# EAGLE design SparkFun_6DoF_ISM330DHCX (EAGLE 9.6.2)
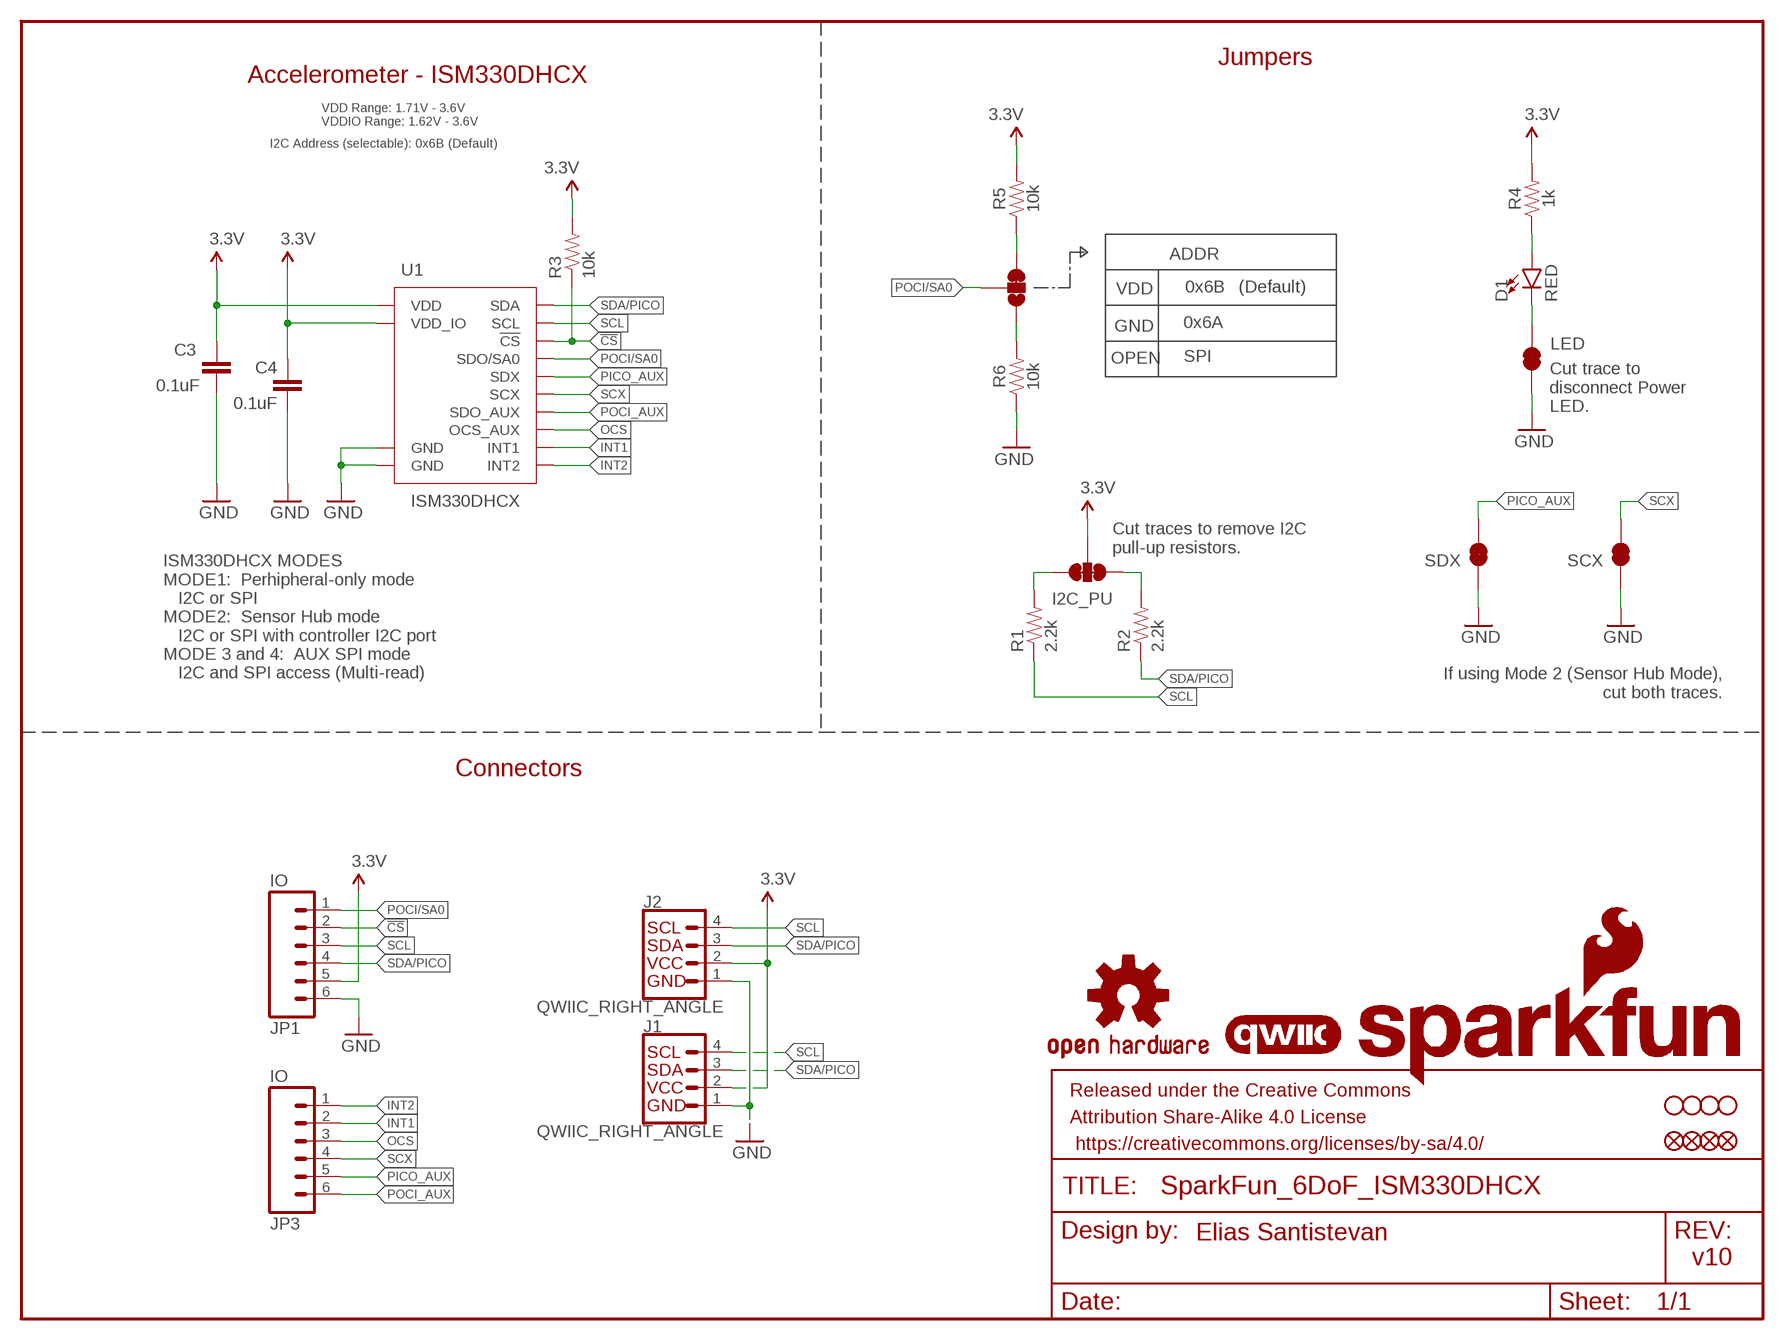
[diagram p0: schematic, sheet 1]

## Parts
ADDR  JUMPER-SMT_3_1-NC_TRACE_SILK  [SMT-JUMPER_3_1-NC_TRACE_SILK]
C3  0.1uF  0.1UF-0603-25V-(+80/-20%)  [0603]
C4  0.1uF  0.1UF-0603-25V-(+80/-20%)  [0603]
D1  RED  LED-RED0603  [LED-0603]
FD1  FIDUCIALUFIDUCIAL  [FIDUCIAL-MICRO]
FD2  FIDUCIALUFIDUCIAL  [FIDUCIAL-MICRO]
FID1  FIDUCIALUFIDUCIAL  [FIDUCIAL-MICRO]
FID2  FIDUCIALUFIDUCIAL  [FIDUCIAL-MICRO]
FRAME1  FRAME-LETTER  [CREATIVE_COMMONS]
I2C_PU  S_MODE  JUMPER-SMT_3_2-NC_TRACE_SILK  [SMT-JUMPER_3_2-NC_TRACE_SILK]
J1  QWIIC_RIGHT_ANGLE  QWIIC_CONNECTORJS-1MM  [JST04_1MM_RA]
J2  QWIIC_RIGHT_ANGLE  QWIIC_CONNECTORJS-1MM  [JST04_1MM_RA]
JP1  IO  CONN_06NO_SILK_NO_POP  [1X06_NO_SILK]
JP3  IO  CONN_06NO_SILK_NO_POP  [1X06_NO_SILK]
LED  JUMPER-SMT_2_NC_TRACE_SILK  [SMT-JUMPER_2_NC_TRACE_SILK]
LOGO1  QWIIC_LOGO_4MM  [QWIIC_4MM]
LOGO2  OSHW-LOGOMINI  [OSHW-LOGO-MINI]
LOGO3  SFE_LOGO_NAME_FLAME.1_INCH  [SFE_LOGO_NAME_FLAME_.1]
R1  2.2k  2.2KOHM-0603-1/10W-1%  [0603]
R2  2.2k  2.2KOHM-0603-1/10W-1%  [0603]
R3  10k  10KOHM-0603-1/10W-1%  [0603]
R4  1k  1KOHM-0603-1/10W-1%  [0603]
R5  10k  10KOHM-0603-1/10W-1%  [0603]
R6  10k  10KOHM-0603-1/10W-1%  [0603]
SCX  JUMPER-SMT_2_NC_TRACE_SILK  [SMT-JUMPER_2_NC_TRACE_SILK]
SDX  JUMPER-SMT_2_NC_TRACE_SILK  [SMT-JUMPER_2_NC_TRACE_SILK]
STANDOFF1  STAND-OFFTIGHT  [STAND-OFF-TIGHT]
STANDOFF2  STAND-OFFTIGHT  [STAND-OFF-TIGHT]
STANDOFF3  STAND-OFFTIGHT  [STAND-OFF-TIGHT]
STANDOFF4  STAND-OFFTIGHT  [STAND-OFF-TIGHT]
U1  ISM330DHCX  [LGA-14L]

## Nets
3.3V: C3.1 C4.1 I2C_PU.2 J1.2 J2.2 JP1.5 R3.2 R4.2 R5.2 U1.P5(VDD_IO) U1.P8(VDD)
!CS!: JP1.2 R3.1 U1.P12(!CS!)
GND: C3.2 C4.2 J1.1 J2.1 JP1.6 LED.1 R6.1 SCX.1 SDX.1 U1.P6(GND) U1.P7(GND)
INT1: JP3.2 U1.P4(INT1)
INT2: JP3.1 U1.P9(INT2)
N$1: ADDR.3 R5.1
N$2: D1.A R4.1
N$3: D1.C LED.2
N$5: I2C_PU.1 R1.2
N$6: I2C_PU.3 R2.2
N$7: ADDR.1 R6.2
OCS: JP3.3 U1.P10(OCS_AUX)
PICO_AUX: JP3.5 SDX.2 U1.P2(SDX)
POCI/SA0: ADDR.2 JP1.1 U1.P1(SDO/SA0)
POCI_AUX: JP3.6 U1.P11(SDO_AUX)
SCL: J1.4 J2.4 JP1.3 R1.1 U1.P13(SCL)
SCX: JP3.4 SCX.2 U1.P3(SCX)
SDA/PICO: J1.3 J2.3 JP1.4 R2.1 U1.P14(SDA)

## Notes on the sheet
- Jumpers
- Accelerometer - ISM330DHCX
- VDD Range: 1.71V - 3.6V
  VDDIO Range: 1.62V - 3.6V
- I2C Address (selectable): 0x6B (Default)
- VDD | 0x6B | (Default)
- GND | 0x6A
- OPEN | SPI
- Cut trace to
  disconnect Power
  LED.
- Cut traces to remove I2C
  pull-up resistors.
- ISM330DHCX MODES
  MODE1:  Perhipheral-only mode
     I2C or SPI
  MODE2:  Sensor Hub mode
     I2C or SPI with controller I2C port
  MODE 3 and 4:  AUX SPI mode
     I2C and SPI access (Multi-read)
- If using Mode 2 (Sensor Hub Mode), 
  cut both traces.
- Connectors
- Elias Santistevan
- v10

## Library data of the parts
ADDR = SparkFun-Jumpers:JUMPER-SMT_3_1-NC_TRACE: Normally closed trace jumper (1 of 2 connections) This jumper has a trace between two pads so it's normally closed (NC). The other connection is normally open (NO). Use a razor knife to open the connection. For best results follow the IPC guidelines for cutting traces: Cutout at least 0.063 mm (0.005 in). Remove all loose material to clean up the cut area. Seal the cut with an approved epoxy. Reapply solder to reclose the connection, or to close the NO connection.
C3 C4 = SparkFun-Capacitors:0.1UF: 0.1µF ceramic capacitors A capacitor is a passive two-terminal electrical component used to store electrical energy temporarily in an electric field.; PROD_ID: CAP-00810
D1 = SparkFun-LED:LED-RED: Red SMD LED Used in manufacturing of most products at SparkFun Packages: 0603 - SMD 0603 package [Product Link] <http://docs.avagotech.com/docs/AV02-0551EN> 0603 SMART - SMD 0603 SMART package ( more efficient and expensive)[Product Link] <http://www.osram-os.com/Graphics/XPic2/00077099_0.pdf> 1206 - SMD1206 package [Product Link] <https://www.sparkfun.com/datasheets/DevTools/LilyPad/Q150OVS4.pdff> SparkFun Products: Pro Mini 328 -5V <https://www.sparkfun.com/products/821> RedBoard <https://www.sparkfun.com/products/12757> IOIO-OTG <https://www.sparkfun.com/products/13613>; PROD_ID: DIO-00819
FD1 FD2 FID1 FID2 = SparkFun-Aesthetics:FIDUCIAL: Fiducial Alignment Points Point-of-reference for pick-and-place machines and other optical instruments.
FRAME1 = SparkFun-Aesthetics:FRAME-LETTER: Schematic Frame - Letter Standard 8.5x11 US Letter frame; DESIGNER: Elias Santistevan
I2C_PU = SparkFun-Jumpers:JUMPER-SMT_3_2-NC_TRACE: Normally closed trace jumper (2 of 2 connections) This jumper has a trace between all three pads so they are normally closed (NC). Use a razor knife to open the connection(s). For best results follow the IPC guidelines for cutting traces: Cutout at least 0.063 mm (0.005 in). Remove all loose material to clean up the cut area. Seal the cut with an approved epoxy. Reapply solder to reclose the connection(s).
J1 J2 = SparkFun-Connectors:QWIIC_CONNECTOR: SparkFun I2C Standard Qwiic Connector An SMD 1mm pitch JST connector makes it easy and quick (get it? Qwiic?) to connect I2C devices to each other. The Qwiic system <http://www.sparkfun.com/qwiic> enables fast and solderless connection between popular platforms and various sensors and actuators. We carry 200mm <https://www.sparkfun.com/products/14204>, 100mm <https://www.sparkfun.com/products/14205>, 50mm <https://www.sparkfun.com/products/14206>, and breadboard friendly <https://www.sparkfun.com/products/14207> Qwiic cables. We also offer 10 pcs strips <https://www.sparkfun.com/products/14323> the SMD connectors.; PROD_ID: CONN-13694
JP1 JP3 = SparkFun-Connectors:CONN_06: Multi connection point. Often used as Generic Header-pin footprint for 0.1 inch spaced/style header connections On any of the 0.1 inch spaced packages, you can populate with these: Break Away Headers - Straight <https://www.sparkfun.com/products/116> (PRT-00116) Break Away Male Headers - Right Angle <https://www.sparkfun.com/products/553> (PRT-00553) Female Headers <https://www.sparkfun.com/products/115> (PRT-00115) Break Away Headers - Machine Pin <https://www.sparkfun.com/products/117> (PRT-00117) Break Away Female Headers - Swiss Machine Pin <https://www.sparkfun.com/products/743> (PRT-00743) Arduino Stackable Header - 6 Pin <https://www.sparkfun.com/products/9280> (PRT-09280) For SCREWTERMINALS and SPRING TERMINALS visit here: Screw Terimnals on SparkFun.com <https://www.sparkfun.com/search/results?term=Screw+Terminals> (5mm/3.5mm/2.54mm spacing) This device is also useful as a general connection point to wire up your design to another part of your project. Our various solder wires solder well into these plated through hole pads. Hook-Up Wire - Assortment (Stranded, 22 AWG) <https://www.sparkfun.com/products/11375> (PRT-11375) Hook-Up Wire - Assortment (Solid Core, 22 AWG) <https://www.sparkfun.com/products/11367> (PRT-11367) View the entire wire category on our website here <https://www.sparkfun.com/categories/141>
LED SCX SDX = SparkFun-Jumpers:JUMPER-SMT_2_NC_TRACE: Normally closed trace jumper This jumper has a trace between two pads so it's normally closed (NC). Use a razor knife to open the connection. For best results follow the IPC guidelines for cutting traces: Cutout at least 0.063 mm (0.005 in). Remove all loose material to clean up the cut area. Seal the cut with an approved epoxy. Reapply solder to reclose the connection.
LOGO1 = SparkFun-Aesthetics:QWIIC_LOGO: Qwiic Logos for placement on schematic and PCB. The 5.5mm silk logo is best for placing next to Qwiic connector.
LOGO2 = SparkFun-Aesthetics:OSHW-LOGO: Open-Source Hardware (OSHW) Logo This logo indicates the piece of hardware it is found on incorporates a OSHW license and/or adheres to the definition of open source hardware found here: http://freedomdefined.org/OSHW
LOGO3 = SparkFun-Aesthetics:SFE_LOGO_NAME_FLAME: SparkFun Font Logo w/ Flame This is the SparkFun full logo. The logo on the schematic will always be the same size; the package variant is the height of the flame part of the logo. Default layer for the logo on the board is tSilk.
R1 R2 = SparkFun-Resistors:2.2KOHM: 2.2kΩ resistor A resistor is a passive two-terminal electrical component that implements electrical resistance as a circuit element. Resistors act to reduce current flow, and, at the same time, act to lower voltage levels within circuits. - Wikipedia; PROD_ID: RES-08272
R3 R5 R6 = SparkFun-Resistors:10KOHM: 10kΩ resistor A resistor is a passive two-terminal electrical component that implements electrical resistance as a circuit element. Resistors act to reduce current flow, and, at the same time, act to lower voltage levels within circuits. - Wikipedia; PROD_ID: RES-00824
R4 = SparkFun-Resistors:1KOHM: 1kΩ resistor A resistor is a passive two-terminal electrical component that implements electrical resistance as a circuit element. Resistors act to reduce current flow, and, at the same time, act to lower voltage levels within circuits. - Wikipedia; PROD_ID: RES-07856
STANDOFF1-STANDOFF4 = SparkFun-Hardware:STAND-OFF: Stand Off Drill holes for mechanically mounting via screws, standoffs, etc. Note: Use the keepout ring to avoid running the screw head into surrounding components. Variant Overviews STAND-OFF - Mechanical footprint for a #4 phillips button head screw. STAND-OFF-TIGHT - Mechanical footprint for a #4 phillips button head screw, Example SparkFun Products Screw - Phillips Head (1/4", 4-40, 10 pack) <https://www.sparkfun.com/products/10453> (PRT-10453) Screw - Phillips Head (1/2", 4-40, 10 pack) <https://www.sparkfun.com/products/10452> (PRT-10452) Screw - Phillips Head (3/4", 4-40, 10 pack) <https://www.sparkfun.com/products/10451> (PRT-10451) Screw - Phillips Head (1", 4-40, 10 pack) <https://www.sparkfun.com/products/10450> (PRT-10450)
U1 = ISM330DHCX:ISM330DHCX: ISM330DHCX 6DoF The ISM330DHCX is a system-in-package featuring a high-performance 3D digital accelerometer and 3D digital gyroscope tailored for Industry 4.0 applications.; PROD_ID: IC-16693

## Board
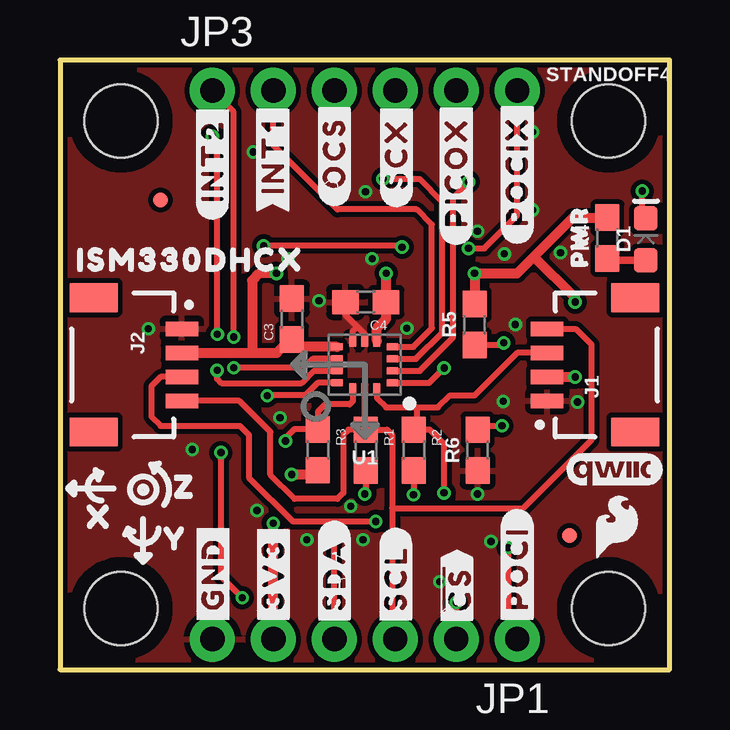
[diagram p1: board, top side]
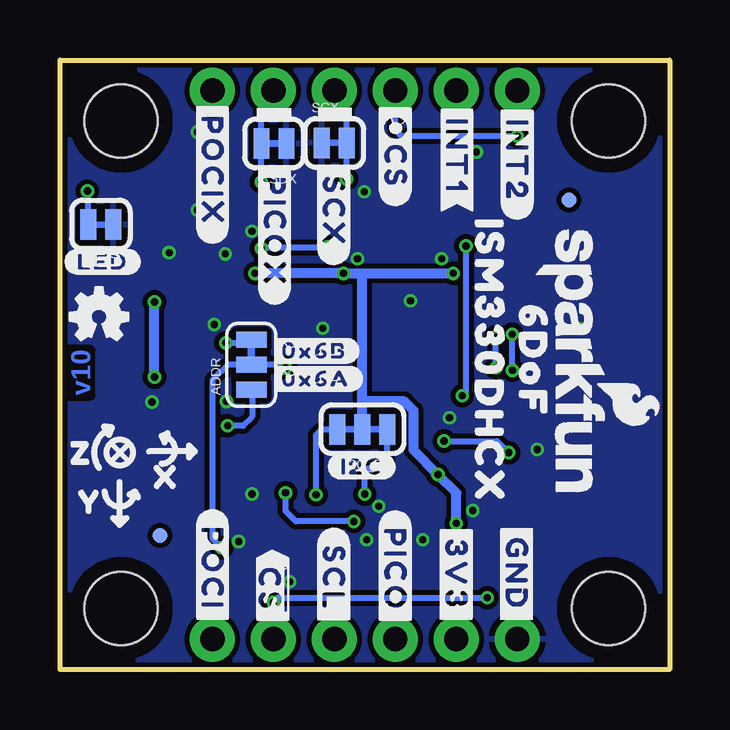
[diagram p2: board, bottom side, seen from below]

Size 25.4 x 25.4 mm. Coordinates in mm from the lower left corner, seen from the top.
Outline: 25.4,25.4 0,25.4 0,0 25.4,0 25.4,25.4
Copper layers (1*16): Top 0.035mm / dielectric 1.5mm / Bottom 0.035mm
Design rules "SparkFun-2-Layer-Minimum-JLCPCB": minimum track width 5mil, minimum drill 0.3mm, track to track 5mil, track to pad 5mil, pad to pad 5mil, via to via 5mil, smd to smd 5mil, copper to edge 7mil, drill to drill 7mil, minimum pad ring 5mil, minimum via ring 5mil, stop-mask expansion 2.5mil, vias tented up to drill 25mil, thermal gap 10mil
tRestrict: area 12.4,13.5 to 12.5,13.8

### Footprints (pad centres in the part's own frame; a part is rotated, then mirrored left to right if it is on the bottom)
SMT-JUMPER_3_1-NC_TRACE_SILK = smd 0.66 x 1.27: 1 -1.041,0; 2 0,0; 3 1.041,0
0603 = smd 1.1 x 1: 1 -0.85,0; 2 0.85,0
LED-0603 = smd 1 x 1: A -0.877,0; C 0.877,0
FIDUCIAL-MICRO = smd 0.635 x 0.635: 1 0,0
SMT-JUMPER_3_2-NC_TRACE_SILK = smd 0.66 x 1.27: 1 -1.041,0; 2 0,0; 3 1.041,0
JST04_1MM_RA = smd 0.6 x 1.35: 1 -1.5,0; 2 -0.5,0; 3 0.5,0; 4 1.5,0 | smd 1.2 x 2: NC1 2.8,-3.675; NC2 -2.8,-3.675
1X06_NO_SILK = drill 1.016 pad 1.88: 1 0,0; 2 2.54,0; 3 5.08,0; 4 7.62,0; 5 10.16,0; 6 12.7,0
SMT-JUMPER_2_NC_TRACE_SILK = smd 0.66 x 1.27: 1 -0.521,0; 2 0.521,0
STAND-OFF-TIGHT = hole 3.048: 0,0
LGA-14L = smd 0.48 x 0.3: P1 -1.163,0.75; P2 -1.163,0.25; P3 -1.163,-0.25; P4 -1.163,-0.75; P8 1.163,-0.75; P9 1.163,-0.25; P10 1.163,0.25; P11 1.163,0.75 | smd 0.3 x 0.48: P5 -0.5,-1; P6 0,-1; P7 0.5,-1; P12 0.5,1; P13 0,1; P14 -0.5,1

### Placement (x,y rotation side)
ADDR  17.43,12.7 90 bottom
C3  9.66,14.61 90 top
C4  12.74,15.32 180 top
D1  24.41,17.93 90 top
FD1  4.19,19.56 0 bottom
FD2  21.23,5.59 0 bottom
FID1  4.19,19.56 0 top
FID2  21.23,5.59 0 top
FRAME1  -19.05,-11.43 0 top  (outside the outline)
I2C_PU  12.8,10.01 180 bottom
J1  20.29,12.7 90 top
J2  5.08,12.7 270 top
JP1  19.05,1.27 180 top
JP3  6.35,24.13 0 top
LED  23.7,18.54 180 bottom
LOGO1  23.11,8.33 0 top
LOGO2  23.77,14.71 0 bottom
LOGO3  4.12,12.79 270 bottom
R1  12.74,9.14 270 top
R2  14.74,9.14 270 top
R3  10.74,9.16 270 top
R4  22.81,17.98 90 top
R5  17.27,14.38 90 top
R6  17.4,9.14 90 top
SCX  13.97,21.95 0 bottom
SDX  16.48,21.92 180 bottom
STANDOFF1  2.54,22.86 0 top
STANDOFF2  2.54,2.54 0 top
STANDOFF3  22.86,2.54 0 top
STANDOFF4  22.86,22.86 0 top
U1  12.7,12.7 180 top
U$1  [#3V3#1]  8.89,3.96 90 top
U$2  [#GND#0]  6.38,3.99 90 top
U$3  [##CS##7]  16.54,3.35 90 top
U$4  [#SDA#4]  11.43,3.96 90 top
U$5  [#SCL#5]  14,3.81 90 top
U$6  [#POCI#11]  19.05,4.22 270 bottom
U$7  [#INT1#9]  8.86,21.39 90 top
U$8  [#INT2#2]  6.35,21.21 270 bottom
U$9  [#OCS#8]  11.43,21.54 90 top
U$10  [#SCX#9]  14.02,21.49 90 top
U$11  [#PICOX#10]  16.51,20.73 90 top
U$12  [ISM330DHCX331]  5.44,17.07 0 top
U$13  [#0X6A#11]  14.73,12.12 0 bottom
U$14  [#0X6B#11]  14.81,13.28 0 bottom
U$15  [#3V3#1]  8.89,3.96 270 bottom
U$16  [#LED#11]  23.62,16.99 0 bottom
U$17  [#GND#0]  6.38,3.99 270 bottom
U$18  [#POCI#12]  19.05,4.22 90 top
U$19  [#INT1#9]  8.86,21.39 270 bottom
U$20  [#OCS#7]  11.43,21.54 270 bottom
U$22  [#SCL#5]  14,3.81 270 bottom
U$23  [#SCX#8]  14,19.08 270 bottom
U$24  [#POCIX#8]  19.05,20.78 90 top
U$25  [#I2C#11]  12.83,8.46 0 bottom
U$26  [#PICO#13]  11.43,4.17 270 bottom
U$27  [##CS##8]  16.54,3.35 270 bottom
U$28  [PWR8]  21.64,18.03 90 top
U$29  [SFE_LOGO_FLAME_.1]  23.19,5.97 0 top
U$30  [ISM330DHCX20]  7.52,12.85 270 bottom
U$31  [6DOF12]  5.69,12.85 270 bottom
U$32  [#PICOX#9]  16.46,18.24 270 bottom
U$33  [#POCIX#7]  19.05,20.78 270 bottom
U$34  [X2114]  1.65,6.35 0 top
U$35  [Y2115]  4.83,5.46 0 top
U$36  [Z2116]  5.21,7.62 0 top
U$37  [X2114]  20.95,8 0 bottom
U$38  [Y2115]  24.13,6.99 0 bottom
U$39  [Z2116]  24.51,9.02 0 bottom
U$40  [#INT2#3]  6.35,21.21 90 top

### Tracks (layer width: path | path; a pad name or v marks a point on that pad's centre or on a via)
3.3V  (via drill 0.3)
  Top 0.406: J2.2 8,13.2 | 8,13.2 9.03,13.2 9.59,13.76 C3.1 9.97,13.45 U1.P8 | U1.P5 13.2,14.22 13.59,14.6 C4.1 v13.59,16.51 | JP1.5 8.89,5.08 v8.89,6.09 | R5.2 v17.27,16.51 19.05,16.51 19.75,17.21 | R4.2 21.37,18.83 19.75,17.21 | v9.02,16.51 8.31,16.51 8,16.2 8,13.2 | R3.2 10.57,8.13 v9.65,8.13 | J1.2 v21.45,12.2 v21.46,12.19 | v21.46,15.32 21.46,15.49 19.75,17.21
  Bottom 0.406: I2C_PU.2 12.8,11.18 | v17.27,16.51 v13.59,16.51 12.83,16.51 | 12.83,16.51 v9.02,16.51 | v8.89,6.09 8.89,7.36 v9.65,8.13 10.67,9.14 10.67,10.79 11.05,11.18 12.8,11.18 | 12.8,11.18 12.8,16.48 12.83,16.51 | v21.46,12.19 v21.46,15.32
!CS!  (via drill 0.3)
  Top 0.254: U1.P12 12.2,11.18 12.06,11.05 11.05,11.05 10.74,10.74 10.74,10.03 | 10.74,10.03 R3.1 | v9.4,9.53 9.4,9.65 9.78,10.03 10.74,10.03 | JP1.2 v16.51,2.79 | v6.71,9.04 6.71,3.89 v7.59,3
  Bottom 0.254: v16.51,2.79 16.31,3 v7.59,3 | v9.4,9.53 7.19,9.53 v6.71,9.04
GND  (via drill 0.3)
  Top 0.254: U1.P6 12.7,13.97 12.38,14.29 | U1.P7 12.2,14.11 12.38,14.29 | 12.38,14.29 11.89,14.78 C4.2
  other vias: 17.4,7.32 10.79,15.37 9.5,17.12 13,17.12 17.4,18.26 3.68,14.2 5.51,9.17 8.2,6.63 9.17,10.49 12.62,5.41 18.47,11.18 14.45,14.22 12.73,19.91 19.68,22.4 19.68,19.15 18.52,17.32 18.97,14.38 15.82,3.66 17.96,5.33 10.29,5.41 20.85,17.37 21.56,11.15 8.05,21.56 12.12,6.81
  pour Bottom (isolate 0.203): 25.4,0 25.4,25.4 0,25.4 0,0
  pour Top (isolate 0.203, rank 2): 25.4,0 25.4,25.4 0,25.4 0,0
INT1
  Top 0.254: U1.P4 14.72,13.45 15.49,14.22 15.49,18.54 14.86,19.18 11.56,19.18 8.89,21.84 JP3.2
INT2  (via drill 0.3)
  Top 0.254: U1.P9 11.43,12.95 10.93,12.95 10.54,12.95 10.16,12.57 v7.24,12.57 | v7.24,13.86 7.24,23.24 JP3.1
  Bottom 0.254: v7.24,12.57 v7.24,13.86
N$1  (via drill 0.3)
  Top 0.254: R5.1 18.4,13.53 v18.49,13.61
  Bottom 0.254: v18.49,13.61 17.56,13.61 ADDR.3
N$2
  Top 0.305: D1.A 22.89,17.05 R4.1
N$3  (via drill 0.3)
  Top 0.254: D1.C 24.26,18.96 v24.26,19.94
  Bottom 0.254: LED.2 24.22,19.9 v24.26,19.94
N$5  (via drill 0.3)
  Top 0.254: R1.2 12.74,7.36 v12.7,7.32
  Bottom 0.254: v12.7,7.32 12.7,8.26 12.57,8.38 12.06,8.38 11.76,8.69 I2C_PU.1
N$6  (via drill 0.3)
  Top 0.254: R2.2 v14.74,7.29 v14.73,7.29
  Bottom 0.254: v14.73,7.29 14.73,9.78 14.5,10.01 I2C_PU.3
N$7  (via drill 0.3)
  Top 0.254: v18.41,10.16 17.78,10.16 17.57,10.16 R6.2
  Bottom 0.254: ADDR.1 17.53,11.56 17.4,11.44 17.4,10.54 17.78,10.16 v18.41,10.16
OCS  (via drill 0.3)
  Top 0.254: v6.55,12.47 6.55,12.12 6.72,11.94 10.07,11.94 10.58,12.45 U1.P10 | v6.56,13.97 6.56,22.02 v6.35,22.23
  Bottom 0.254: v6.55,12.47 6.55,13.96 v6.56,13.97 | v6.35,22.23 11.18,22.23 11.43,22.48 JP3.3
PICO_AUX  (via drill 0.3)
  Top 0.254: U1.P2 14.99,12.45 16.38,13.84 16.38,19.68 v17.02,20.32
  Bottom 0.254: v17.02,20.32 17,20.33 SDX.2 17,23.64 JP3.5
POCI/SA0  (via drill 0.3)
  Top 0.254: U1.P1 15.38,11.95 v16,12.57 | JP1.1 18.67,1.65 v18.67,5.08
  Bottom 0.254: v16,12.57 16.14,12.7 ADDR.2 18.41,12.7 19.05,12.07 19.05,5.46 v18.67,5.08
POCI_AUX  (via drill 0.3)
  Top 0.254: U1.P11 10.74,11.95 10.22,11.43 8.66,11.43 v8.64,11.41 | v14.25,17.6 14.2,17.65 v8.48,17.65 | v17.02,17.55 17.68,17.55 19.05,18.92 JP3.6
  Bottom 0.254: v8.64,11.41 8.48,11.56 v8.48,17.65 | v17.02,17.55 16.97,17.6 v14.25,17.6
SCL
  Top 0.254: R1.1 12.74,10.28 12.7,10.33 U1.P13 | J1.4 21.49,14.2 22.15,13.54 22.15,9.58 19.3,6.73 13.84,6.73 | R1.1 12.03,9.99 11.81,9.78 11.81,7.37 11.56,7.11 9.78,7.11 8.76,8.13 8.76,9.91 7.47,11.2 J2.4 | R1.1 13.63,9.99 13.84,9.78 13.84,6.73 | JP1.3 13.84,1.4 13.84,6.73
SCX  (via drill 0.3)
  Top 0.254: U1.P3 14.83,12.95 15.93,14.04 15.93,19.48 14.96,20.45 v13.46,20.45
  Bottom 0.254: v13.46,20.45 13.46,21.93 SCX.2 13.45,23.61 JP3.4
SDA/PICO  (via drill 0.3)
  Top 0.254: J1.3 19.04,13.2 17.27,11.43 16.26,11.43 15.75,10.92 14.86,10.92 | J2.3 4.2,12.2 3.81,11.81 3.81,10.54 4.19,10.16 7.49,10.16 7.87,9.78 7.87,8 9.7,6.17 11.43,6.17 | v16,7.36 16,9.4 15.41,9.99 R2.1 14.65,10.08 14.86,10.29 14.86,10.92 | U1.P14 13.2,11.31 13.59,10.92 14.86,10.92 | JP1.4 11.43,6.17 | 11.43,6.17 v13.16,6.17
  Bottom 0.254: v16,7.36 16,6.6 15.57,6.17 v13.16,6.17

### Text on the board
Bottom: v10